# EAGLE design DRV8825Board (EAGLE 9.4.2)
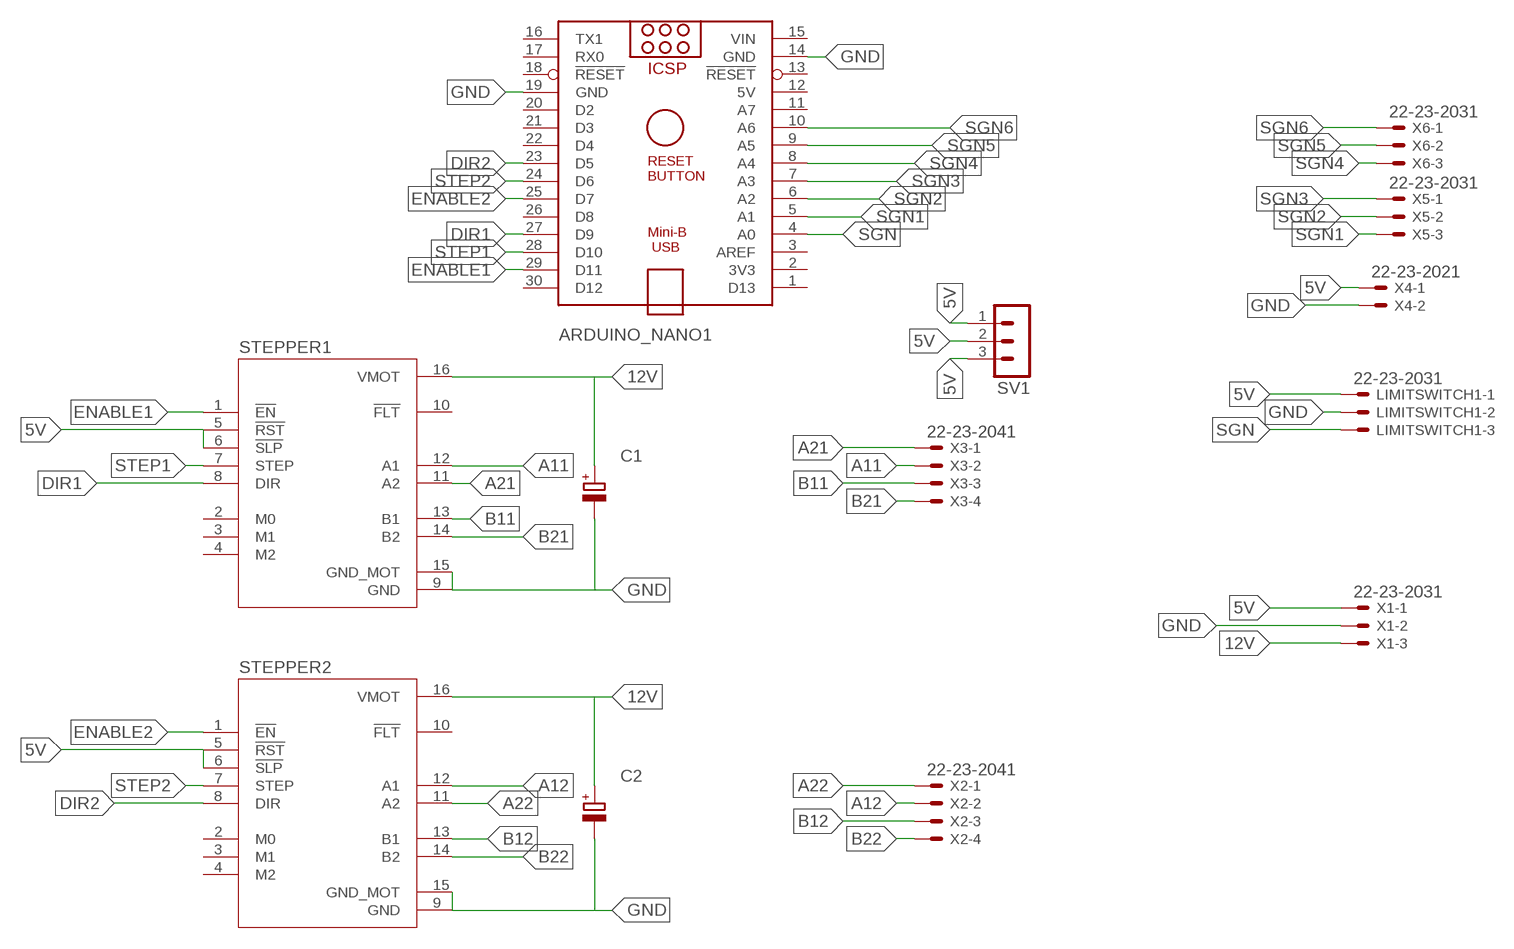
[diagram p0: schematic, sheet 1]

## Parts
ARDUINO_NANO1  ARDUINO_NANO  [ARDUINO_NANO]
C1  CPOL-EUE2.5-6  [E2,5-6]
C2  CPOL-EUE2.5-6  [E2,5-6]
LIMITSWITCH1  22-23-2031  [22-23-2031]
STEPPER1  DRV8825_STEPPER_MOTOR_DRIVER_CARRIER  [IC_DRV8825_STEPPER_MOTOR_DRIVER_CARRIER]
STEPPER2  DRV8825_STEPPER_MOTOR_DRIVER_CARRIER  [IC_DRV8825_STEPPER_MOTOR_DRIVER_CARRIER]
SV1  MA03-1  [MA03-1]
X1  22-23-2031  [22-23-2031]
X2  22-23-2041  [22-23-2041]
X3  22-23-2041  [22-23-2041]
X4  22-23-2021  [22-23-2021]
X5  22-23-2031  [22-23-2031]
X6  22-23-2031  [22-23-2031]

## Nets
5V: LIMITSWITCH1.1 STEPPER1.5(!RST) STEPPER1.6(!SLP) STEPPER2.5(!RST) STEPPER2.6(!SLP) SV1.1 SV1.2 SV1.3 X1.1 X4.1
12V: C1.+ C2.+ STEPPER1.16(VMOT) STEPPER2.16(VMOT) X1.3
A11: STEPPER1.12(A1) X3.2
A12: STEPPER2.12(A1) X2.2
A21: STEPPER1.11(A2) X3.1
A22: STEPPER2.11(A2) X2.1
B11: STEPPER1.13(B1) X3.3
B12: STEPPER2.13(B1) X2.3
B21: STEPPER1.14(B2) X3.4
B22: STEPPER2.14(B2) X2.4
DIR1: ARDUINO_NANO1.27(D9) STEPPER1.8(DIR)
DIR2: ARDUINO_NANO1.23(D5) STEPPER2.8(DIR)
ENABLE1: ARDUINO_NANO1.29(D11) STEPPER1.1(!EN)
ENABLE2: ARDUINO_NANO1.25(D7) STEPPER2.1(!EN)
GND: ARDUINO_NANO1.14(GND) ARDUINO_NANO1.19(GND) C1.- C2.- LIMITSWITCH1.2 STEPPER1.9(GND) STEPPER1.15(GND_MOT) STEPPER2.9(GND) STEPPER2.15(GND_MOT) X1.2 X4.2
SGN: ARDUINO_NANO1.4(A0) LIMITSWITCH1.3
SGN1: ARDUINO_NANO1.5(A1) X5.3
SGN2: ARDUINO_NANO1.6(A2) X5.2
SGN3: ARDUINO_NANO1.7(A3) X5.1
SGN4: ARDUINO_NANO1.8(A4) X6.3
SGN5: ARDUINO_NANO1.9(A5) X6.2
SGN6: ARDUINO_NANO1.10(A6) X6.1
STEP1: ARDUINO_NANO1.28(D10) STEPPER1.7(STEP)
STEP2: ARDUINO_NANO1.24(D6) STEPPER2.7(STEP)
Unconnected: ARDUINO_NANO1.1(D13) ARDUINO_NANO1.2(3V3) ARDUINO_NANO1.3(AREF) ARDUINO_NANO1.11(A7) ARDUINO_NANO1.13(!RESET) ARDUINO_NANO1.16(TX1) ARDUINO_NANO1.17(RX0) ARDUINO_NANO1.18(!RESET) ARDUINO_NANO1.20(D2) ARDUINO_NANO1.21(D3) ARDUINO_NANO1.22(D4) ARDUINO_NANO1.26(D8) ARDUINO_NANO1.30(D12) STEPPER1.2(M0) STEPPER1.3(M1) STEPPER1.4(M2) STEPPER1.10(!FLT) STEPPER2.2(M0) STEPPER2.3(M1) STEPPER2.4(M2) STEPPER2.10(!FLT)

## Power pins joined to a net without a drawn wire
5V: ARDUINO_NANO1.12(5V)
VIN: ARDUINO_NANO1.15(VIN)

## Library data of the parts
ARDUINO_NANO1 = ArduinoNanoV30:ARDUINO_NANO: Arduino Nano V3.0 Overview: The Arduino Nano is a small, complete, and breadboard-friendly board based on the ATmega328 (Arduino Nano 3.x) or ATmega168 (Arduino Nano 2.x). It has more or less the same functionality of the Arduino Duemilanove, but in a different package. It lacks only a DC power jack, and works with a Mini-B USB cable instead of a standard one. The Nano was designed and is being produced by Gravitech. Specifications: Microcontroller Atmel ATmega168 or ATmega328 Operating Voltage (logic level) 5 V Input Voltage (recommended) 7-12 V Input Voltage (limits) 6-20 V Digital I/O Pins 14 (of which 6 provide PWM output) Analog Input Pins 8 DC Current per I/O Pin 40 mA Flash Memory 16 KB (ATmega168) or 32 KB (ATmega328) of which 2 KB used by bootloader SRAM 1 KB (ATmega168) or 2 KB (ATmega328) EEPROM 512 bytes (ATmega168) or 1 KB (ATmega328) Clock Speed 16 MHz Dimensions 0.73" x 1.70" Length 45 mm Width 18 mm Weigth 5 g Power: The Arduino Nano can be powered via the Mini-B USB connection, 6-20V unregulated external power supply (pin 30), or 5V regulated external power supply (pin 27). The power source is automatically selected to the highest voltage source. Memory: The ATmega168 has 16 KB of flash memory for storing code (of which 2 KB is used for the bootloader); the ATmega328 has 32 KB, (also with 2 KB used for the bootloader). The ATmega168 has 1 KB of SRAM and 512 bytes of EEPROM (which can be read and written with the EEPROM library); the ATmega328 has 2 KB of SRAM and 1 KB of EEPROM. Input and Output: Each of the 14 digital pins on the Nano can be used as an input or output, using pinMode(), digitalWrite(), and digitalRead() functions. They operate at 5 volts. Each pin can provide or receive a maximum of 40 mA and has an internal pull-up resistor (disconnected by default) of 20-50 kOhms. In addition, some pins have specialized functions. Visit Arduino - ArduinoBoardNano <https://www.arduino.cc/en/Main/ArduinoBoardNano>
C1 C2 = rcl:CPOL-EU: POLARIZED CAPACITOR, European symbol; SPICEPREFIX: C
LIMITSWITCH1 X1 X5 X6 = con-molex:22-23-2031: .100" (2.54mm) Center Header - 3 Pin; MF: MOLEX; MPN: 22-23-2031; OC_FARNELL: 1462950; OC_NEWARK: 30C0862
STEPPER1 STEPPER2 = DRV8825_STEPPER_MOTOR_DRIVER_CARRIER:DRV8825_STEPPER_MOTOR_DRIVER_CARRIER: Stepper motor controler; IC: DRV8825; 1.5A; Uin mot: 8.2÷45V; AVAILABILITY: Unavailable; DESCRIPTION: Stepper, Bipolar 8.2 ~ 45VDC Supply 1.5A 8.2 ~ 45V Load; MF: Pololu; MP: DRV8825 STEPPER MOTOR DRIVER CARRIER; PACKAGE: None; PRICE: None
SV1 = con-lstb:MA03-1: PIN HEADER; OC_FARNELL: unknown; OC_NEWARK: unknown
X2 X3 = con-molex:22-23-2041: .100" (2.54mm) Center Header - 4 Pin; MF: MOLEX; MPN: 22-23-2041; OC_FARNELL: 1462920; OC_NEWARK: 38C0355
X4 = con-molex:22-23-2021: .100" (2.54mm) Center Header - 2 Pin; MF: MOLEX; MPN: 22-23-2021; OC_FARNELL: 1462926; OC_NEWARK: 25C3832

## Board
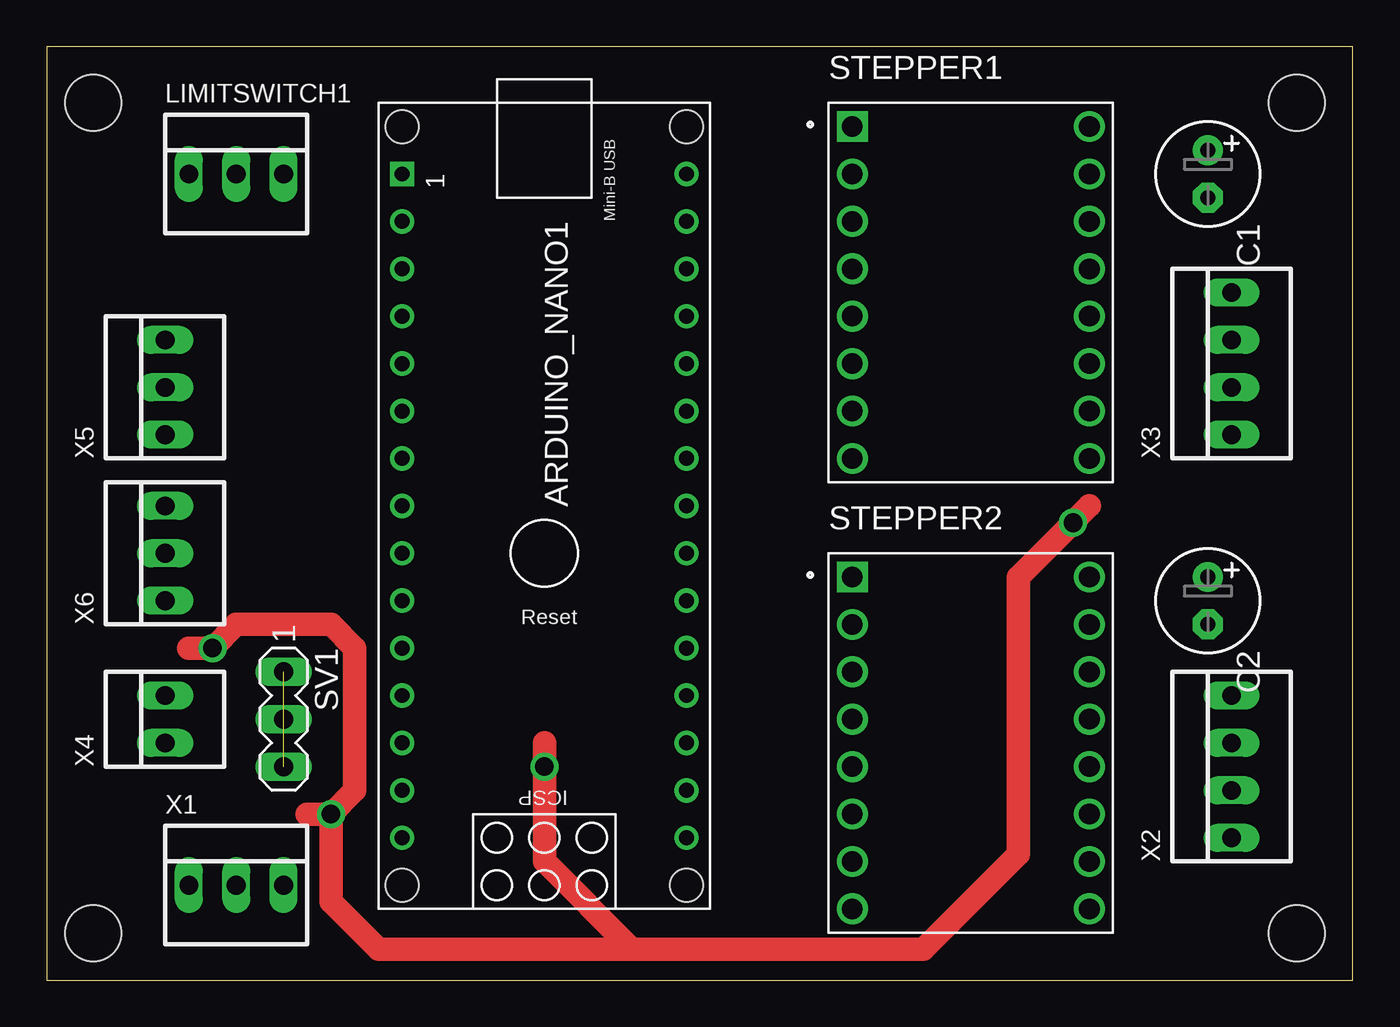
[diagram p1: board, top side]
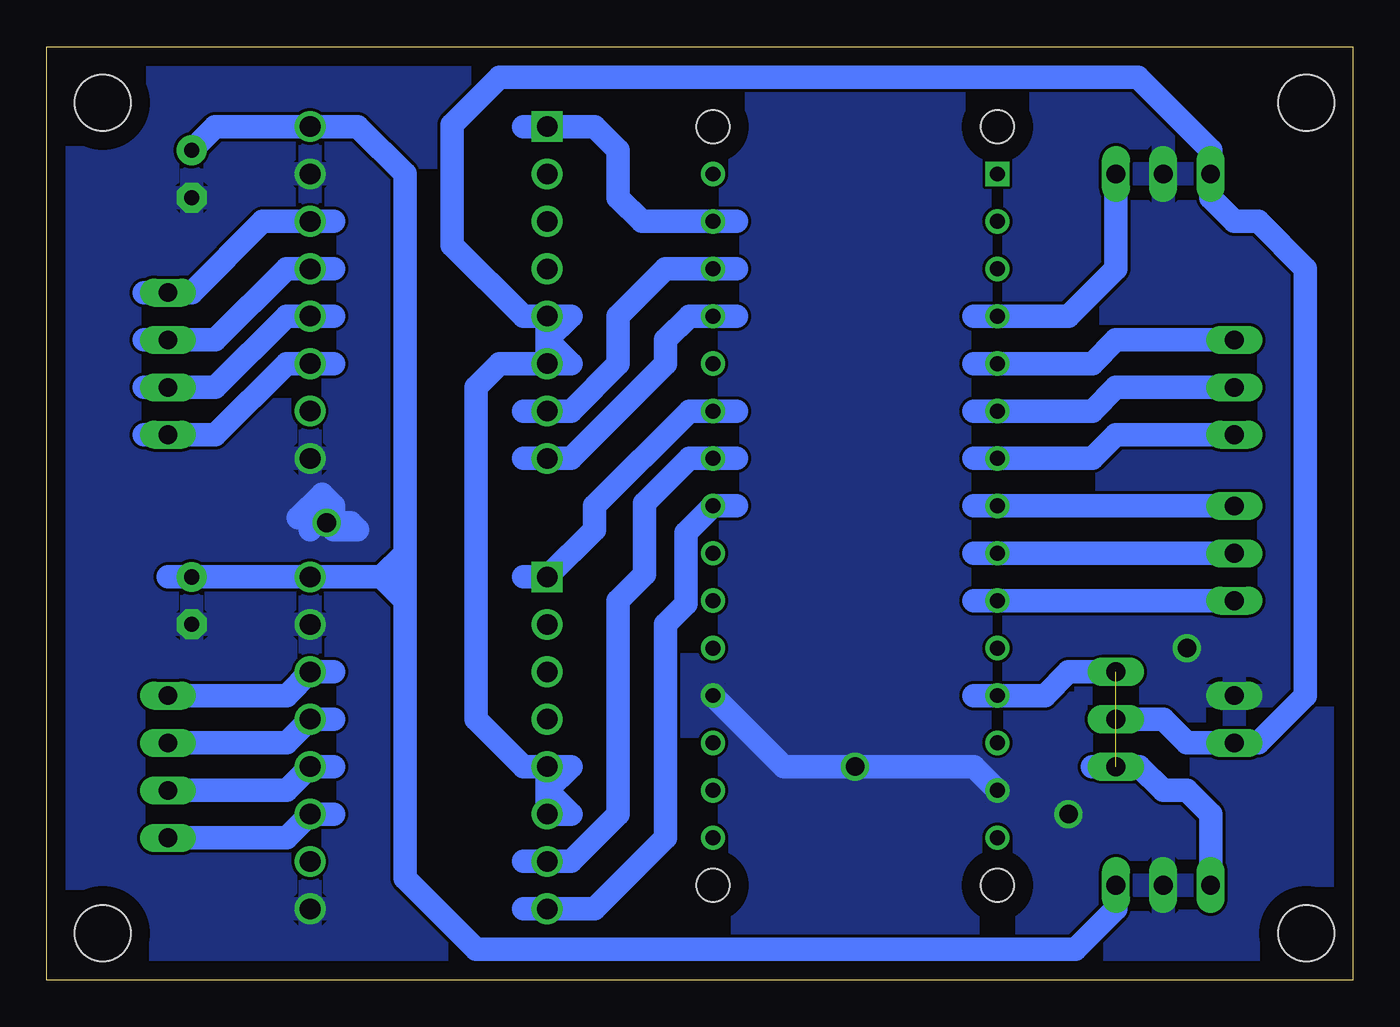
[diagram p2: board, bottom side, seen from below]

Size 70 x 50 mm. Coordinates in mm from the lower left corner, seen from the top.
Outline: 0,0 70,0 70,50 0,50 0,0
Copper layers (1*16): Top 0.035mm / dielectric 1.5mm / Bottom 0.035mm
Design rules "default": minimum track width 6mil, minimum drill 0.35mm, track to track 6mil, track to pad 6mil, pad to pad 6mil, via to via 6mil, smd to smd 6mil, copper to edge 40mil, drill to drill 6mil, minimum pad ring 10mil, minimum via ring 8mil, stop-mask expansion 4mil, vias tented up to drill 0mil, thermal gap 10mil
Holes 3 mm at 2.5,2.5 67,2.5 2.5,47 67,47

### Footprints (pad centres in the part's own frame; a part is rotated, then mirrored left to right if it is on the bottom)
ARDUINO_NANO = drill 0.8 square: 1 -20.32,-7.62 | drill 0.8: 2 -17.78,-7.62; 3 -15.24,-7.62; 4 -12.7,-7.62; 5 -10.16,-7.62; 6 -7.62,-7.62; 7 -5.08,-7.62; 8 -2.54,-7.62; 9 0,-7.62; 10 2.54,-7.62; 11 5.08,-7.62; 12 7.62,-7.62; 13 10.16,-7.62; 14 12.7,-7.62; 15 15.24,-7.62; 16 15.24,7.62; 17 12.7,7.62; 18 10.16,7.62; 19 7.62,7.62; 20 5.08,7.62; 21 2.54,7.62; 22 0,7.62; 23 -2.54,7.62; 24 -5.08,7.62; 25 -7.62,7.62; 26 -10.16,7.62; 27 -12.7,7.62; 28 -15.24,7.62; 29 -17.78,7.62; 30 -20.32,7.62 | hole 1.778: -22.86,-7.62; -22.86,7.62; 17.78,7.62; 17.78,-7.62
E2,5-6 = drill 0.813 pad 1.6: + -1.27,0 | drill 0.813 pad 1.6 octagon: - 1.27,0
22-23-2031 = drill 1 long: 1 -2.54,0; 2 0,0; 3 2.54,0
IC_DRV8825_STEPPER_MOTOR_DRIVER_CARRIER = drill 1.1 square: 1 -6.35,8.89 | drill 1.1: 2 -6.35,6.35; 3 -6.35,3.81; 4 -6.35,1.27; 5 -6.35,-1.27; 6 -6.35,-3.81; 7 -6.35,-6.35; 8 -6.35,-8.89; 9 6.35,-8.89; 10 6.35,-6.35; 11 6.35,-3.81; 12 6.35,-1.27; 13 6.35,1.27; 14 6.35,3.81; 15 6.35,6.35; 16 6.35,8.89
MA03-1 = drill 1.016 long: 1 -2.54,0; 2 0,0; 3 2.54,0
22-23-2041 = drill 1 long: 1 -3.81,0; 2 -1.27,0; 3 1.27,0; 4 3.81,0
22-23-2021 = drill 1 long: 1 -1.27,0; 2 1.27,0

### Placement (x,y rotation side)
ARDUINO_NANO1  26.67,22.86 270 top
C1  62.23,43.18 270 top
C2  62.23,20.32 270 top
LIMITSWITCH1  10.16,43.18 0 top
STEPPER1  49.53,36.83 0 top
STEPPER2  49.53,12.7 0 top
SV1  12.7,13.97 270 top
X1  10.16,5.08 0 top
X2  63.5,11.43 90 top
X3  63.5,33.02 90 top
X4  6.35,13.97 90 top
X5  6.35,31.75 90 top
X6  6.35,22.86 90 top

### Tracks (layer width: path | path; a pad name or v marks a point on that pad's centre or on a via)
5V  (2 unrouted)
  Bottom 1.27: 13.97,11.43 SV1.3 11.43,11.43 10.16,10.16 8.89,10.16 7.62,8.89 X1.1 | SV1.1 15.24,16.51 16.51,15.24 ARDUINO_NANO1.12 20.32,15.24 | STEPPER1.5 43.18,34.29 | 43.18,34.29 STEPPER1.6 | STEPPER1.5 41.91,35.56 43.18,34.29 | STEPPER1.6 41.91,33.02 43.18,34.29 | STEPPER2.5 43.18,10.16 | 43.18,10.16 STEPPER2.6 41.91,8.89 43.18,10.16 | STEPPER2.5 41.91,11.43 43.18,10.16 | STEPPER1.5 44.45,35.56 48.26,39.37 48.26,45.81 45.72,48.35 11.52,48.35 7.62,44.45 LIMITSWITCH1.1 7.62,41.91 6.35,40.64 5.08,40.64 2.54,38.1 2.54,15.24 5.08,12.7 X4.1 8.89,12.7 10.16,13.97 SV1.2 | STEPPER1.6 45.72,33.02 46.99,31.75 46.99,13.97 44.45,11.43 STEPPER2.5
12V
  Bottom 1.27: 63.5,21.59 C2.+ STEPPER2.16 52.07,21.59 | C1.+ 60.96,45.72 STEPPER1.16 53.34,45.72 50.8,43.18 50.8,22.86 | 50.8,22.86 50.8,20.32 | 50.8,20.32 50.8,5.46 46.99,1.65 14.86,1.65 12.7,3.81 X1.3 | 50.8,20.32 52.07,21.59 | 52.07,21.59 50.8,22.86
A11
  Bottom 1.27: 54.61,35.56 STEPPER1.12 57.15,35.56 60.96,31.75 X3.2 64.77,31.75
A12
  Bottom 1.27: X2.2 57.15,10.16 STEPPER2.12 54.61,11.43
A21
  Bottom 1.27: 54.61,33.02 STEPPER1.11 57.15,33.02 60.96,29.21 X3.1 64.77,29.21
A22
  Bottom 1.27: X2.1 57.15,7.62 STEPPER2.11 54.61,8.89
B11
  Bottom 1.27: 54.61,38.1 STEPPER1.13 57.15,38.1 60.96,34.29 X3.3 64.77,34.29
B12
  Bottom 1.27: X2.3 57.15,12.7 STEPPER2.13 54.61,13.97
B21
  Bottom 1.27: 54.61,40.64 STEPPER1.14 58.42,40.64 62.23,36.83 X3.4 64.77,36.83
B22
  Bottom 1.27: X2.4 57.15,15.24 STEPPER2.14 54.61,16.51
DIR1
  Bottom 1.27: 44.45,27.94 STEPPER1.8 41.91,27.94 36.83,33.02 36.83,34.29 35.56,35.56 ARDUINO_NANO1.27 33.02,35.56
DIR2
  Bottom 1.27: 44.45,3.81 STEPPER2.8 40.64,3.81 36.83,7.62 36.83,19.05 35.73,20.15 35.73,23.96 ARDUINO_NANO1.23 33.02,25.4
ENABLE1
  Bottom 1.27: 44.45,45.72 STEPPER1.1 40.64,45.72 39.37,44.45 39.37,41.91 38.1,40.64 ARDUINO_NANO1.29 33.02,40.64
ENABLE2
  Bottom 1.27: 33.02,30.48 ARDUINO_NANO1.25 35.56,30.48 40.64,25.4 40.64,24.13 STEPPER2.1 44.45,21.59
GND  (via drill 1)
  Top 1.27: 31.37,1.65 26.67,6.35 v26.67,11.43 26.67,12.7 | 31.37,1.65 46.99,1.65 52.07,6.73 52.07,21.57 v55,24.5 55,24.52 55.88,25.4 | v15.24,8.89 16.51,10.16 16.51,17.78 15.24,19.05 10.16,19.05 v8.89,17.78 7.62,17.78 | v15.24,8.89 13.97,8.89 | 31.37,1.65 17.78,1.65 15.24,4.19 v15.24,8.89
  Bottom 1.27: ARDUINO_NANO1.14 20.32,11.43 v26.67,11.43 30.48,11.43 ARDUINO_NANO1.19 | 55.88,24.13 55.51,24.5 v55,24.5 53.71,24.5 53.34,24.13 54.63,24.13 54.61,24.15 54.61,25.4 55.24,26.04 56.52,24.77
  pour Bottom: -5.08,41.91 -5.08,50.8 -1.27,54.61 69.85,54.61 73.66,50.8 73.66,33.02 73.66,0 68.58,-5.08 -2.54,-5.08 -5.08,-2.54
SGN
  Bottom 1.27: LIMITSWITCH1.3 12.7,38.1 15.24,35.56 ARDUINO_NANO1.4 20.32,35.56
SGN1
  Bottom 1.27: X5.3 12.7,34.29 13.97,33.02 ARDUINO_NANO1.5 20.32,33.02
SGN2
  Bottom 1.27: X5.2 12.7,31.75 13.97,30.48 ARDUINO_NANO1.6 20.32,30.48
SGN3
  Bottom 1.27: X5.1 12.7,29.21 13.97,27.94 ARDUINO_NANO1.7 20.32,27.94
SGN4
  Bottom 1.27: X6.3 ARDUINO_NANO1.8 20.32,25.4
SGN5
  Bottom 1.27: X6.2 ARDUINO_NANO1.9 20.32,22.86
SGN6
  Bottom 1.27: X6.1 ARDUINO_NANO1.10 20.32,20.32
STEP1
  Bottom 1.27: 44.45,30.48 STEPPER1.7 41.91,30.48 39.37,33.02 39.37,35.56 36.83,38.1 ARDUINO_NANO1.28 33.02,38.1
STEP2
  Bottom 1.27: 44.45,6.35 STEPPER2.7 41.91,6.35 39.37,8.89 39.37,20.32 37.95,21.74 37.95,25.55 35.56,27.94 ARDUINO_NANO1.24 33.02,27.94